# Altium schematic sheet trigger_interface.SchDoc
size A4; SheetNumber: 6; SheetTotal: 8
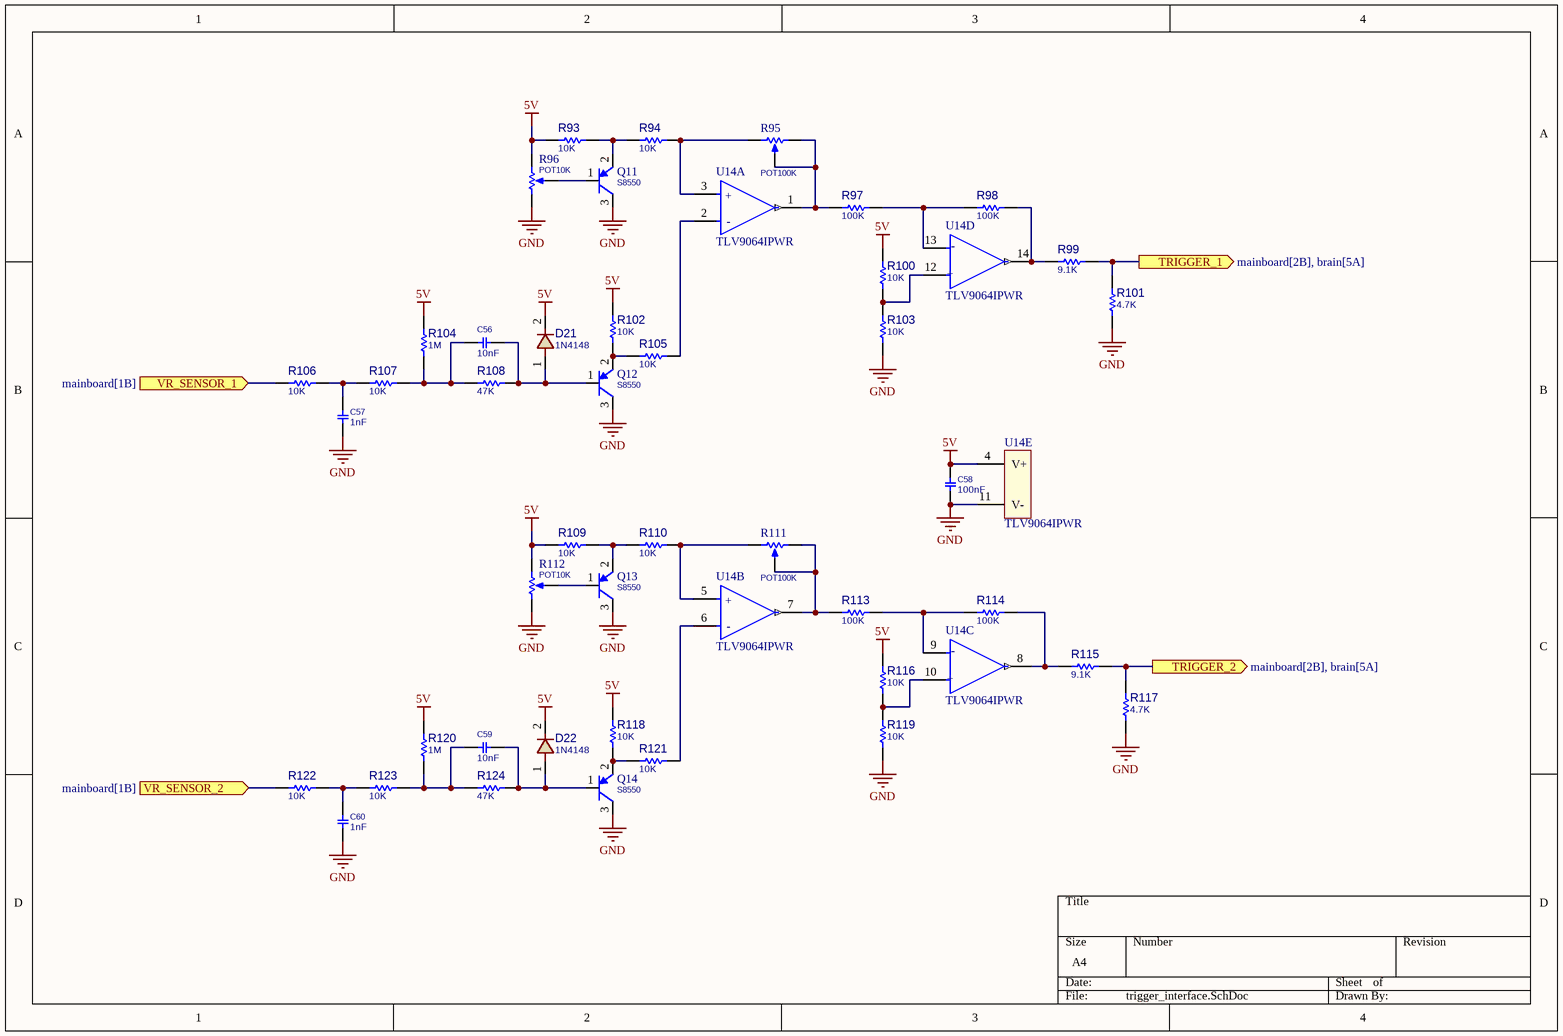
[diagram p0: trigger_interface.SchDoc]

## Parts
C56  10nF  [C0805]
C57  1nF  [C0805]
C58  100nF  [C0805]
C59  10nF  [C0805]
C60  1nF  [C0805]
D21  1N4148  [D_SOD80]
D22  1N4148  [D_SOD80]
Q11  S8550  [SOT23_3]
Q12  S8550  [SOT23_3]
Q13  S8550  [SOT23_3]
Q14  S8550  [SOT23_3]
R93  10K  [R0805]
R94  10K  [R0805]
R95  POT100K  [POT_7X5]
R96  POT10K  [POT_7X5]
R97  100K  [R0805]
R98  100K  [R0805]
R99  9.1K  [R0805]
R100  10K  [R0805]
R101  4.7K  [R0805]
R102  10K  [R0805]
R103  10K  [R0805]
R104  1M  [R0805]
R105  10K  [R0805]
R106  10K  [R0805]
R107  10K  [R0805]
R108  47K  [R0805]
R109  10K  [R0805]
R110  10K  [R0805]
R111  POT100K  [POT_7X5]
R112  POT10K  [POT_7X5]
R113  100K  [R0805]
R114  100K  [R0805]
R115  9.1K  [R0805]
R116  10K  [R0805]
R117  4.7K  [R0805]
R118  10K  [R0805]
R119  10K  [R0805]
R120  1M  [R0805]
R121  10K  [R0805]
R122  10K  [R0805]
R123  10K  [R0805]
R124  47K  [R0805]
U14  TLV9064IPWR  [TTSOP-14]  (parts A,B,C,D,E of 5)

## Ports
TRIGGER_1 (out, see mainboard[2B], brain[5A]), TRIGGER_2 (out, see mainboard[2B], brain[5A]), VR_SENSOR_1 (in, see mainboard[1B]), VR_SENSOR_2 (in, see mainboard[1B])

## Nets
5V: C58.2 D21.2 D22.2 R93.1 R96.3(BOT) R100.2 R102.1 R104.1 R109.1 R112.3(BOT) R116.2 R118.1 R120.1 U14.4(V+)
GND: C57.1 C58.1 C60.1 Q11.3(C) Q12.3(C) Q13.3(C) Q14.3(C) R96.1(TOP) R101.1 R103.2 R112.1(TOP) R117.1 R119.2 U14.11(V-)
TRIGGER_1: R99.2 R101.2 ; port TRIGGER_1
TRIGGER_2: R115.2 R117.2 ; port TRIGGER_2
VR_SENSOR_1: R106.2 ; port VR_SENSOR_1
VR_SENSOR_2: R122.2 ; port VR_SENSOR_2
NetC56_1: C56.1 D21.1 Q12.1(B) R108.1
NetC56_2: C56.2 R104.2 R107.1 R108.2
NetC57_2: C57.2 R106.1 R107.2
NetC59_1: C59.1 D22.1 Q14.1(B) R124.1
NetC59_2: C59.2 R120.2 R123.1 R124.2
NetC60_2: C60.2 R122.1 R123.2
NetQ11_1: Q11.1(B) R96.2(TAP)
NetQ11_2: Q11.2(E) R93.2 R94.1
NetQ12_2: Q12.2(E) R102.2 R105.1
NetQ13_1: Q13.1(B) R112.2(TAP)
NetQ13_2: Q13.2(E) R109.2 R110.1
NetQ14_2: Q14.2(E) R118.2 R121.1
NetR94_2: R94.2 R95.1(TOP) U14.3(IN1+)
NetR95_2: R95.2(TAP) R95.3(BOT) R97.1 U14.1(OUT1)
NetR97_2: R97.2 R98.1 U14.13(IN4-)
NetR98_2: R98.2 R99.1 U14.14(OUT4)
NetR100_1: R100.1 R103.1 U14.12(IN4+)
NetR105_2: R105.2 U14.2(IN1-)
NetR110_2: R110.2 R111.1(TOP) U14.5(IN2+)
NetR111_2: R111.2(TAP) R111.3(BOT) R113.1 U14.7(OUT2)
NetR113_2: R113.2 R114.1 U14.9(IN3-)
NetR114_2: R114.2 R115.1 U14.8(OUT3)
NetR116_1: R116.1 R119.1 U14.10(IN3+)
NetR121_2: R121.2 U14.6(IN2-)

## Notes on the sheet
- (in symbol TLV9064, part A) +; -
- (in symbol TLV9064, part B) +; -
- (in symbol TLV9064, part C) -; +
- (in symbol TLV9064, part D) -; +

## Library data of the parts
C56-C60 = CAP_SMD_MLCC: CAP, MLCC; PARAM: C0G, 10%; DESC: CAP, MLCC, 1nF, 50V, C0G, 10%, 0402; MANF_P#: MANF_PART#; MANF: Murata; PARAM2: 50V; PRICE: 100= 1$; ASSEMBLY: ASSEMBLY
  C56 C59: VALUE: 10nF
  C57 C60: VALUE: 1nF
  C58: VALUE: 100nF
D21 D22 = DIODE_SMD_1N4148_SOD80: DIODE, FAST SWTICHING, 0.3A, 0.5W; DESC: DESCRIPTION; PARAM: 75V; PARAM2: 300mA, 0.5W; MANF: MANF; ASSEMBLY: ASSEMBLY; PRICE: PRICE; MANF_P#: 1N4148; VALUE: 1N4148
Q11-Q14 = PNP_S8550_SOT23: BJT, PNP, 25v, 0.5A, SMD, SOT23; PARAM2: 300mW; PARAM: 25v, 0.5A; MANF_P#: S8550; MANF: -; VALUE: S8550
R93 R94 R97-R110 R113-R124 = RES_SMD: RESISTOR, SMD; PARAM: -W; DESC: DESCRIPTION; DIST#: MOUSER; PARAM2: 1%; MANF_P#: -; MANF: -; ASSEMBLY: ASSEMBLY; PRICE: 100= 0.5$
  R93 R94 R100 R102 R103 R105-R107 R109 R110 R116 R118 R119 R121-R123: VALUE: 10K
  R97 R98 R113 R114: VALUE: 100K
  R99 R115: VALUE: 9.1K
  R101 R117: VALUE: 4.7K
  R104 R120: VALUE: 1M
  R108 R124: VALUE: 47K
R95 R96 R111 R112 = RES_THD_POT_7X5: RESISTOR, THD, Potentiometer
  R95 R111: VALUE: POT100K
  R96 R112: VALUE: POT10K
U14 = TLV9064: IC CMOS 4 CIRCUIT 14TSSOP; Output Current per Channel: 50mA; Gain Bandwidth Product: 10MHz; Operating Supply Current: 538uA; Input Bias Current: 0.5pA; Input Offset Voltage (Vos): 300uV; Number of Channels: 4; Slew Rate: 6.5V/µs; Mount: Surface Mount; Min Operating Temperature: -40°C; Case/Package: TSSOP; RoHS Compliant: Yes; Packaging: Tape and Reel; Number of Pins: 14; Number of Circuits: 4; Max Operating Temperature: 125°C